# EasyEDA Pro project ProProject_2024电赛校赛_2024-05-27.epro

# Schematic Schematic2
Create Date: 2024-05-11; Page Name: P1; Project Name: 2024电赛校赛; Schematic Name: Schematic2; Update Date: 2024-05-11; Company: 嘉立创EDA; Page Size: A4; Version: V1.0
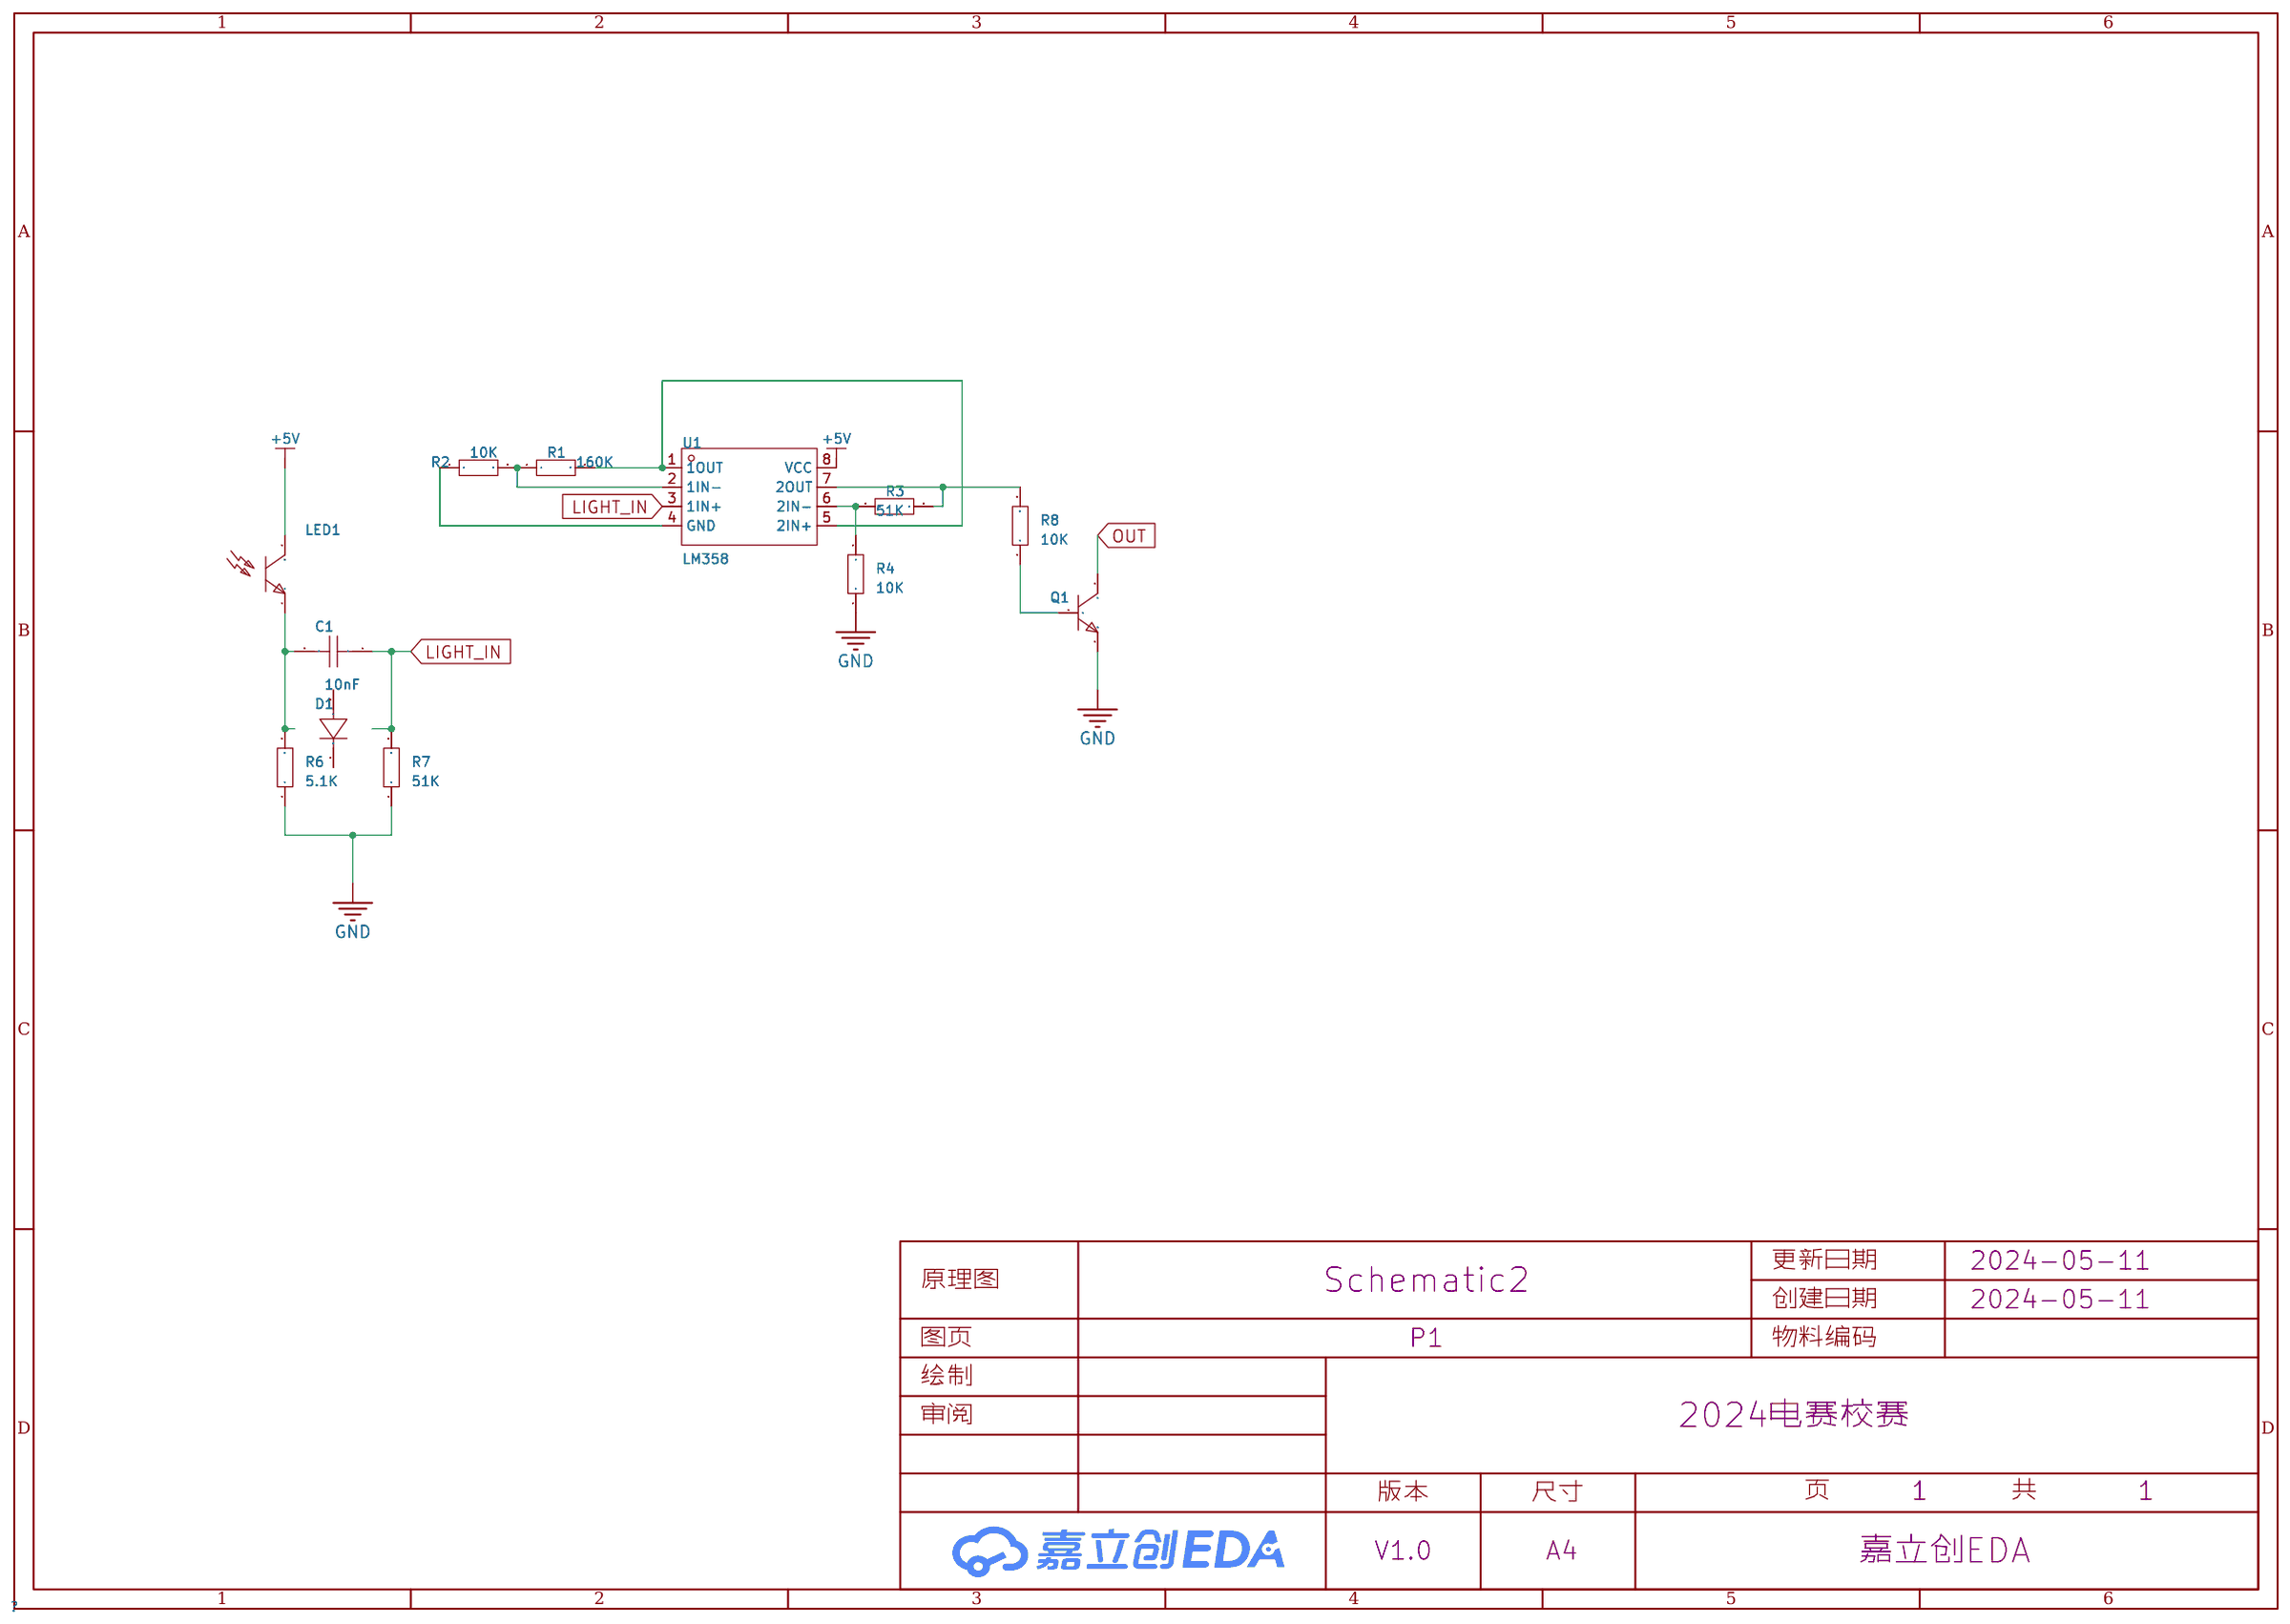
[diagram p0: schematic sheet]

## Parts
C1  10nF  [C0603]
D1  -  [DO_1N4007]
LED1  MHL524PT03BRT  [LED-TH_BD5.8-P2.54-RD]
Q1  -  [S8050_SOT-23]
R1  160K  [R0603]
R2  10K  [R0603]
R3  51K  [R0603]
R4  10K  [R0603]
R6  5.1K  [R0603]
R7  51K  [R0603]
R8  10K  [R0603]
U1  LM358  [SOP-8_L5.0-W4.0-P1.27-LS6.0-BL]

## Library data of the parts
C1 = CAP_0603: Supplier Footprint: 0603
D1 = D_1N4007A: Supplier Footprint: DO-41
LED1 = MHL524PT03BRT: 晶体管类型:NPN;集电极-发射极电压(Vceo):30V;集电极电流-Ic:1.2mA;最大功耗:10mW;集电极暗电流:100nA;峰值波长:940nm;; LCSC Part Name: 940nm的NPN光电三极管; Supplier Part: C405261; Manufacturer: MEIHUA(美华); Supplier Footprint: 插件,D=5mm; Datasheet: https://atta.szlcsc.com/upload/public/pdf/source/20190731/C405261_B286ACA8E3E1B3273BC9C132C68D299C.pdf; Supplier: LCSC; Transistor Type: NPN; Collector Emitter Voltage: 30V; Collector Current (Ic): 1.2mA; Dissipation Power(Max): 10mW; Collector Dark Current: 100nA; Peak Wavelength: 940nm; Operating Temperature: -35℃~+85℃
Q1 = S8050_SOT_NPN: Supplier Footprint: SOT-23
R1-R4 R6-R8 = Res_0603: Supplier Footprint: 0603
U1 = LM358: 放大器数:-;输入失调电压(Vos):9V;带宽(-3db):1MHz;; LCSC Part Name: 停产; Supplier Part: C329455; Manufacturer: IDCHIP(英锐芯); Supplier Footprint: SOP-8; JLCPCB Part Class: 扩展库; Datasheet: https://atta.szlcsc.com/upload/public/pdf/source/20190220/C329455_57B3E72C7E5AADCB3F5B4A8F23CFDE4F.pdf; Supplier: LCSC; Voltage - Input Offset(Vos): 9V; Common Mode Rejection Ratio (CMRR): 65dB; Supply Voltage: 3V~30V; -3db Bandwidth: 1MHz

## Nets
+5V: LED1.2(C) U1.8(VCC)
GND: Q1.2 R4.1 R6.1 R7.1
LIGHT_IN: C1.1 D1.2(A) R7.2 U1.3(1IN+)
OUT: Q1.3
Net-(C1-2): C1.2 D1.1(K) LED1.1(E) R6.2
Net-(Q1-1): Q1.1 R8.1
Net-(R1-1): R1.1 R2.2 U1.2(1IN-)
Net-(R1-2): R1.2 U1.1(1OUT) U1.5(2IN+)
Net-(R2-1): R2.1 U1.4(GND)
Net-(R3-1): R3.1 R4.2 U1.6(2IN-)
Net-(R3-2): R3.2 R8.2 U1.7(2OUT)

# Schematic Schematic1

## Sheets
1 主控: Create Date: 2024-05-06; Page Name: 主控; Project Name: 2024电赛校赛; Schematic Name: Schematic1; Update Date: 2024-05-06; Company: 嘉立创EDA; Page Size: A4; Version: V1.0
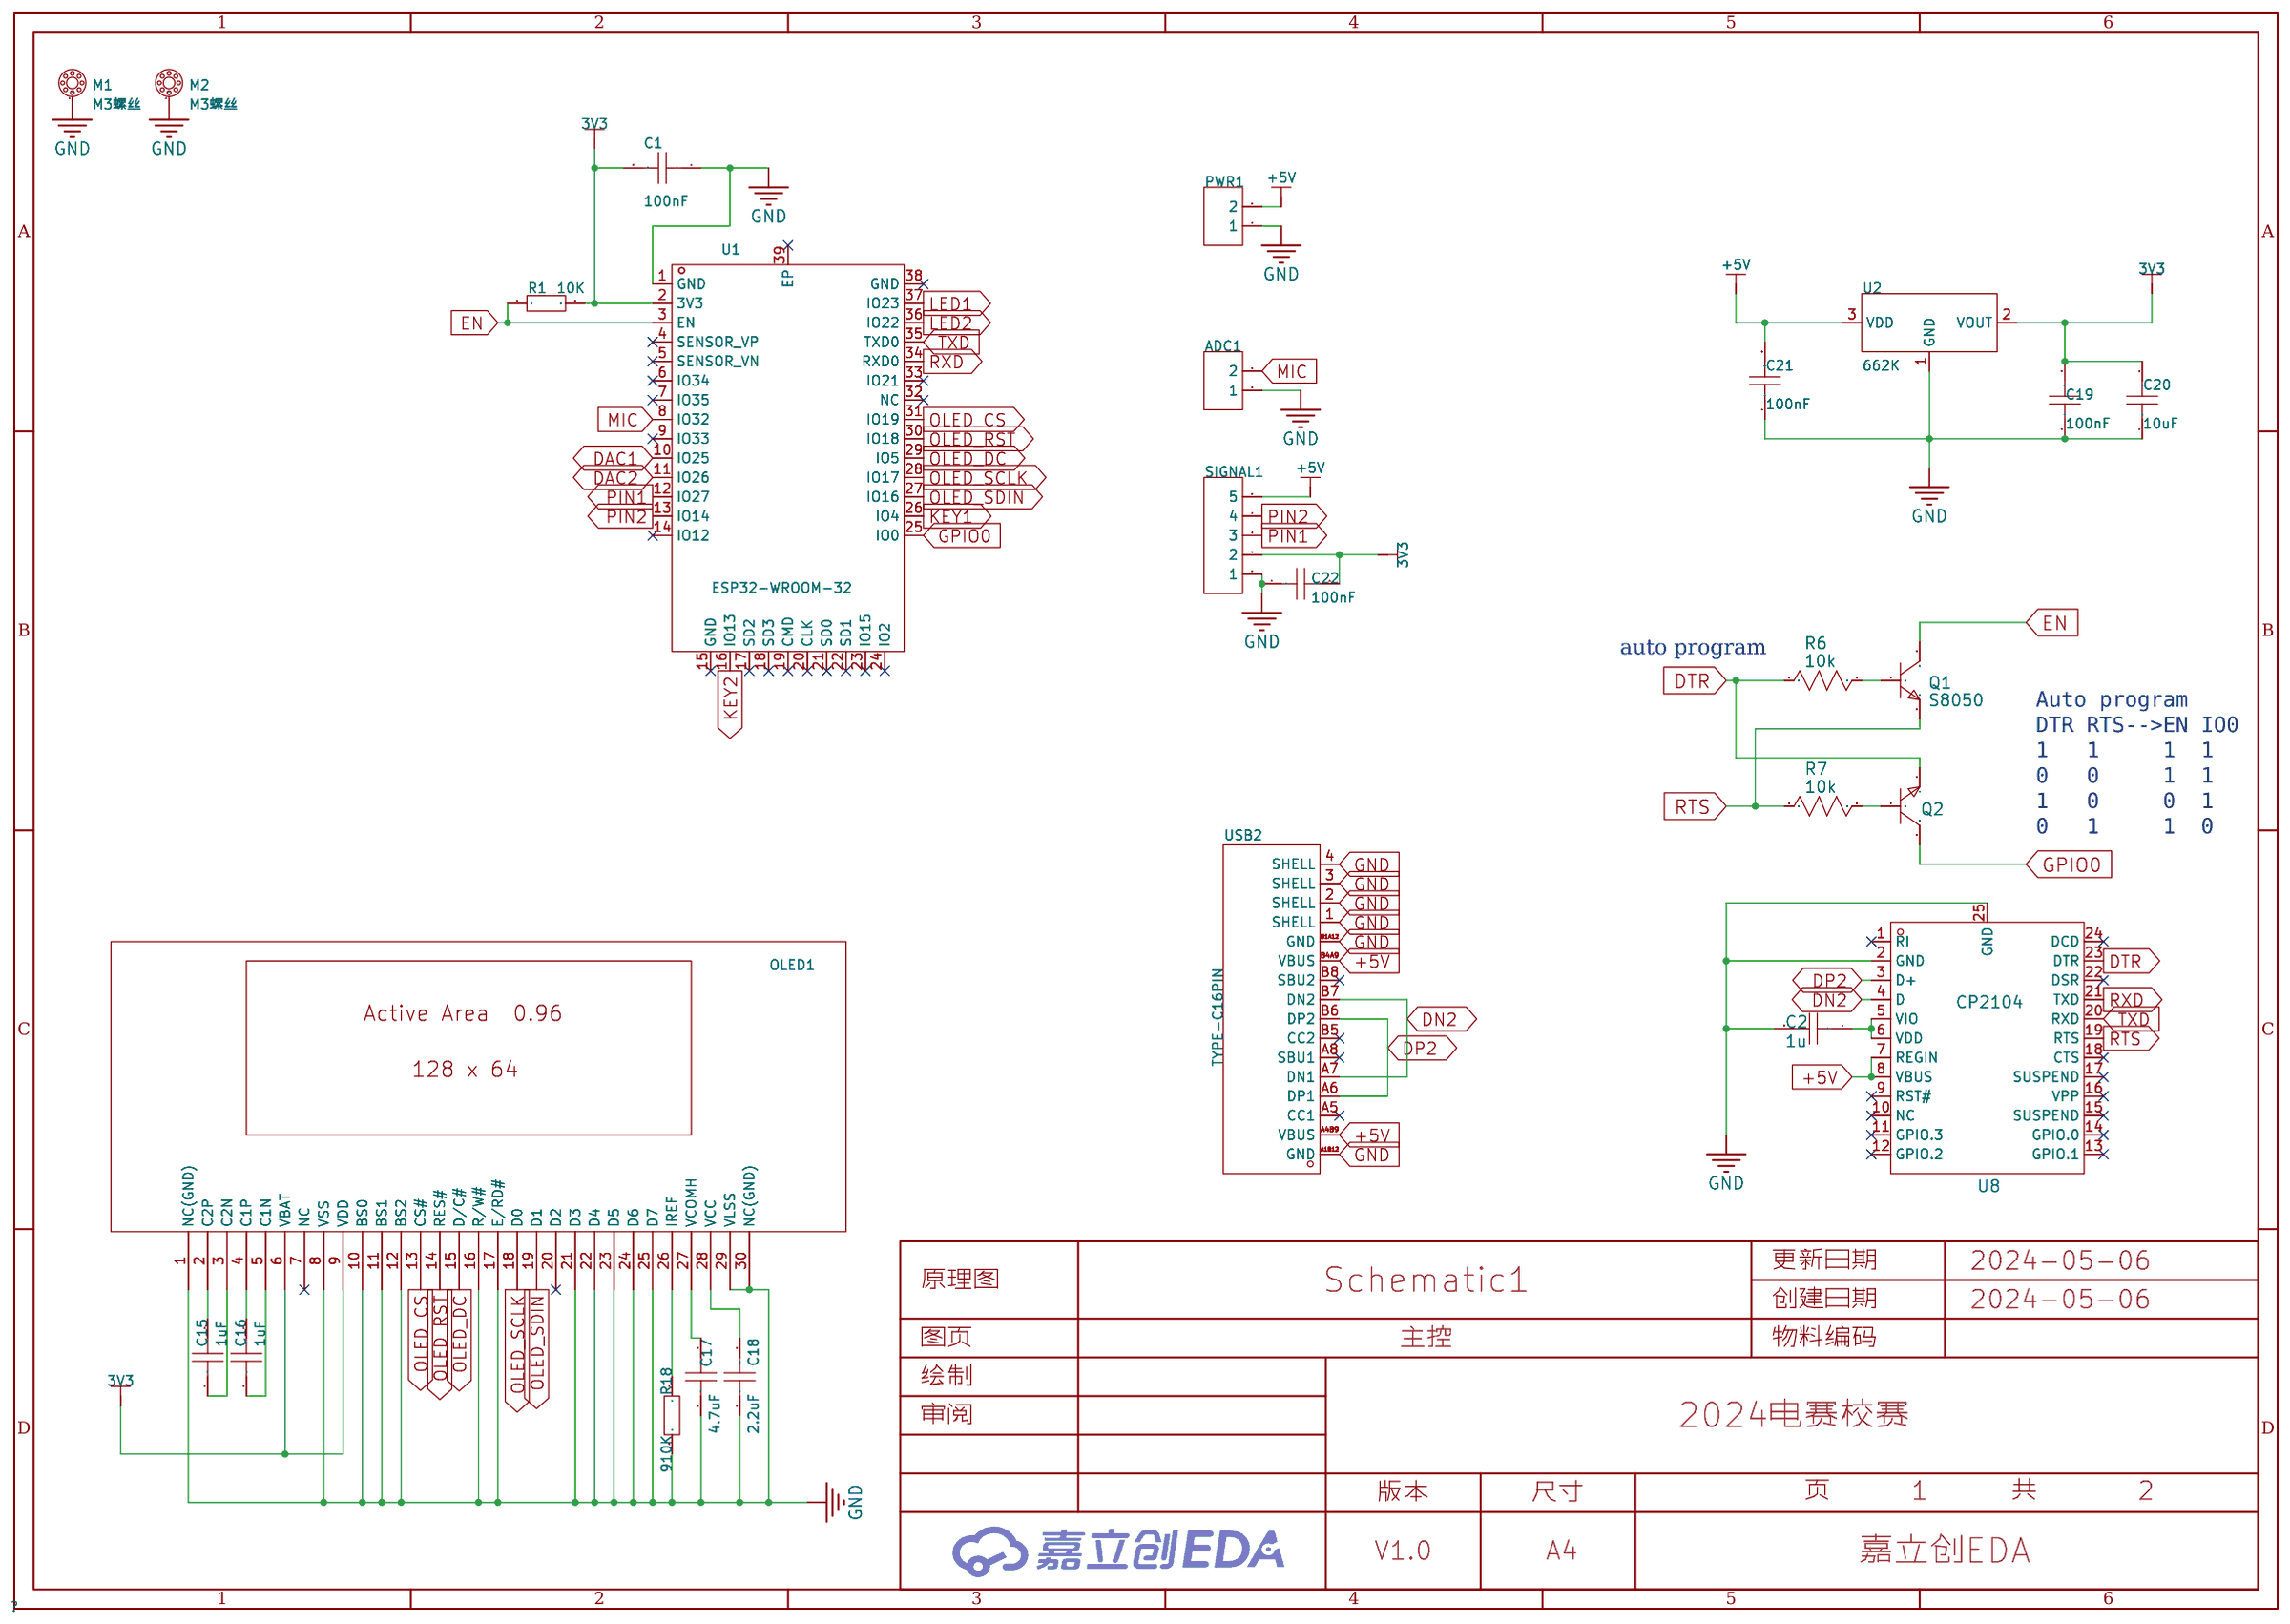
[diagram p1: 主控]
2 外设: Page Name: 外设
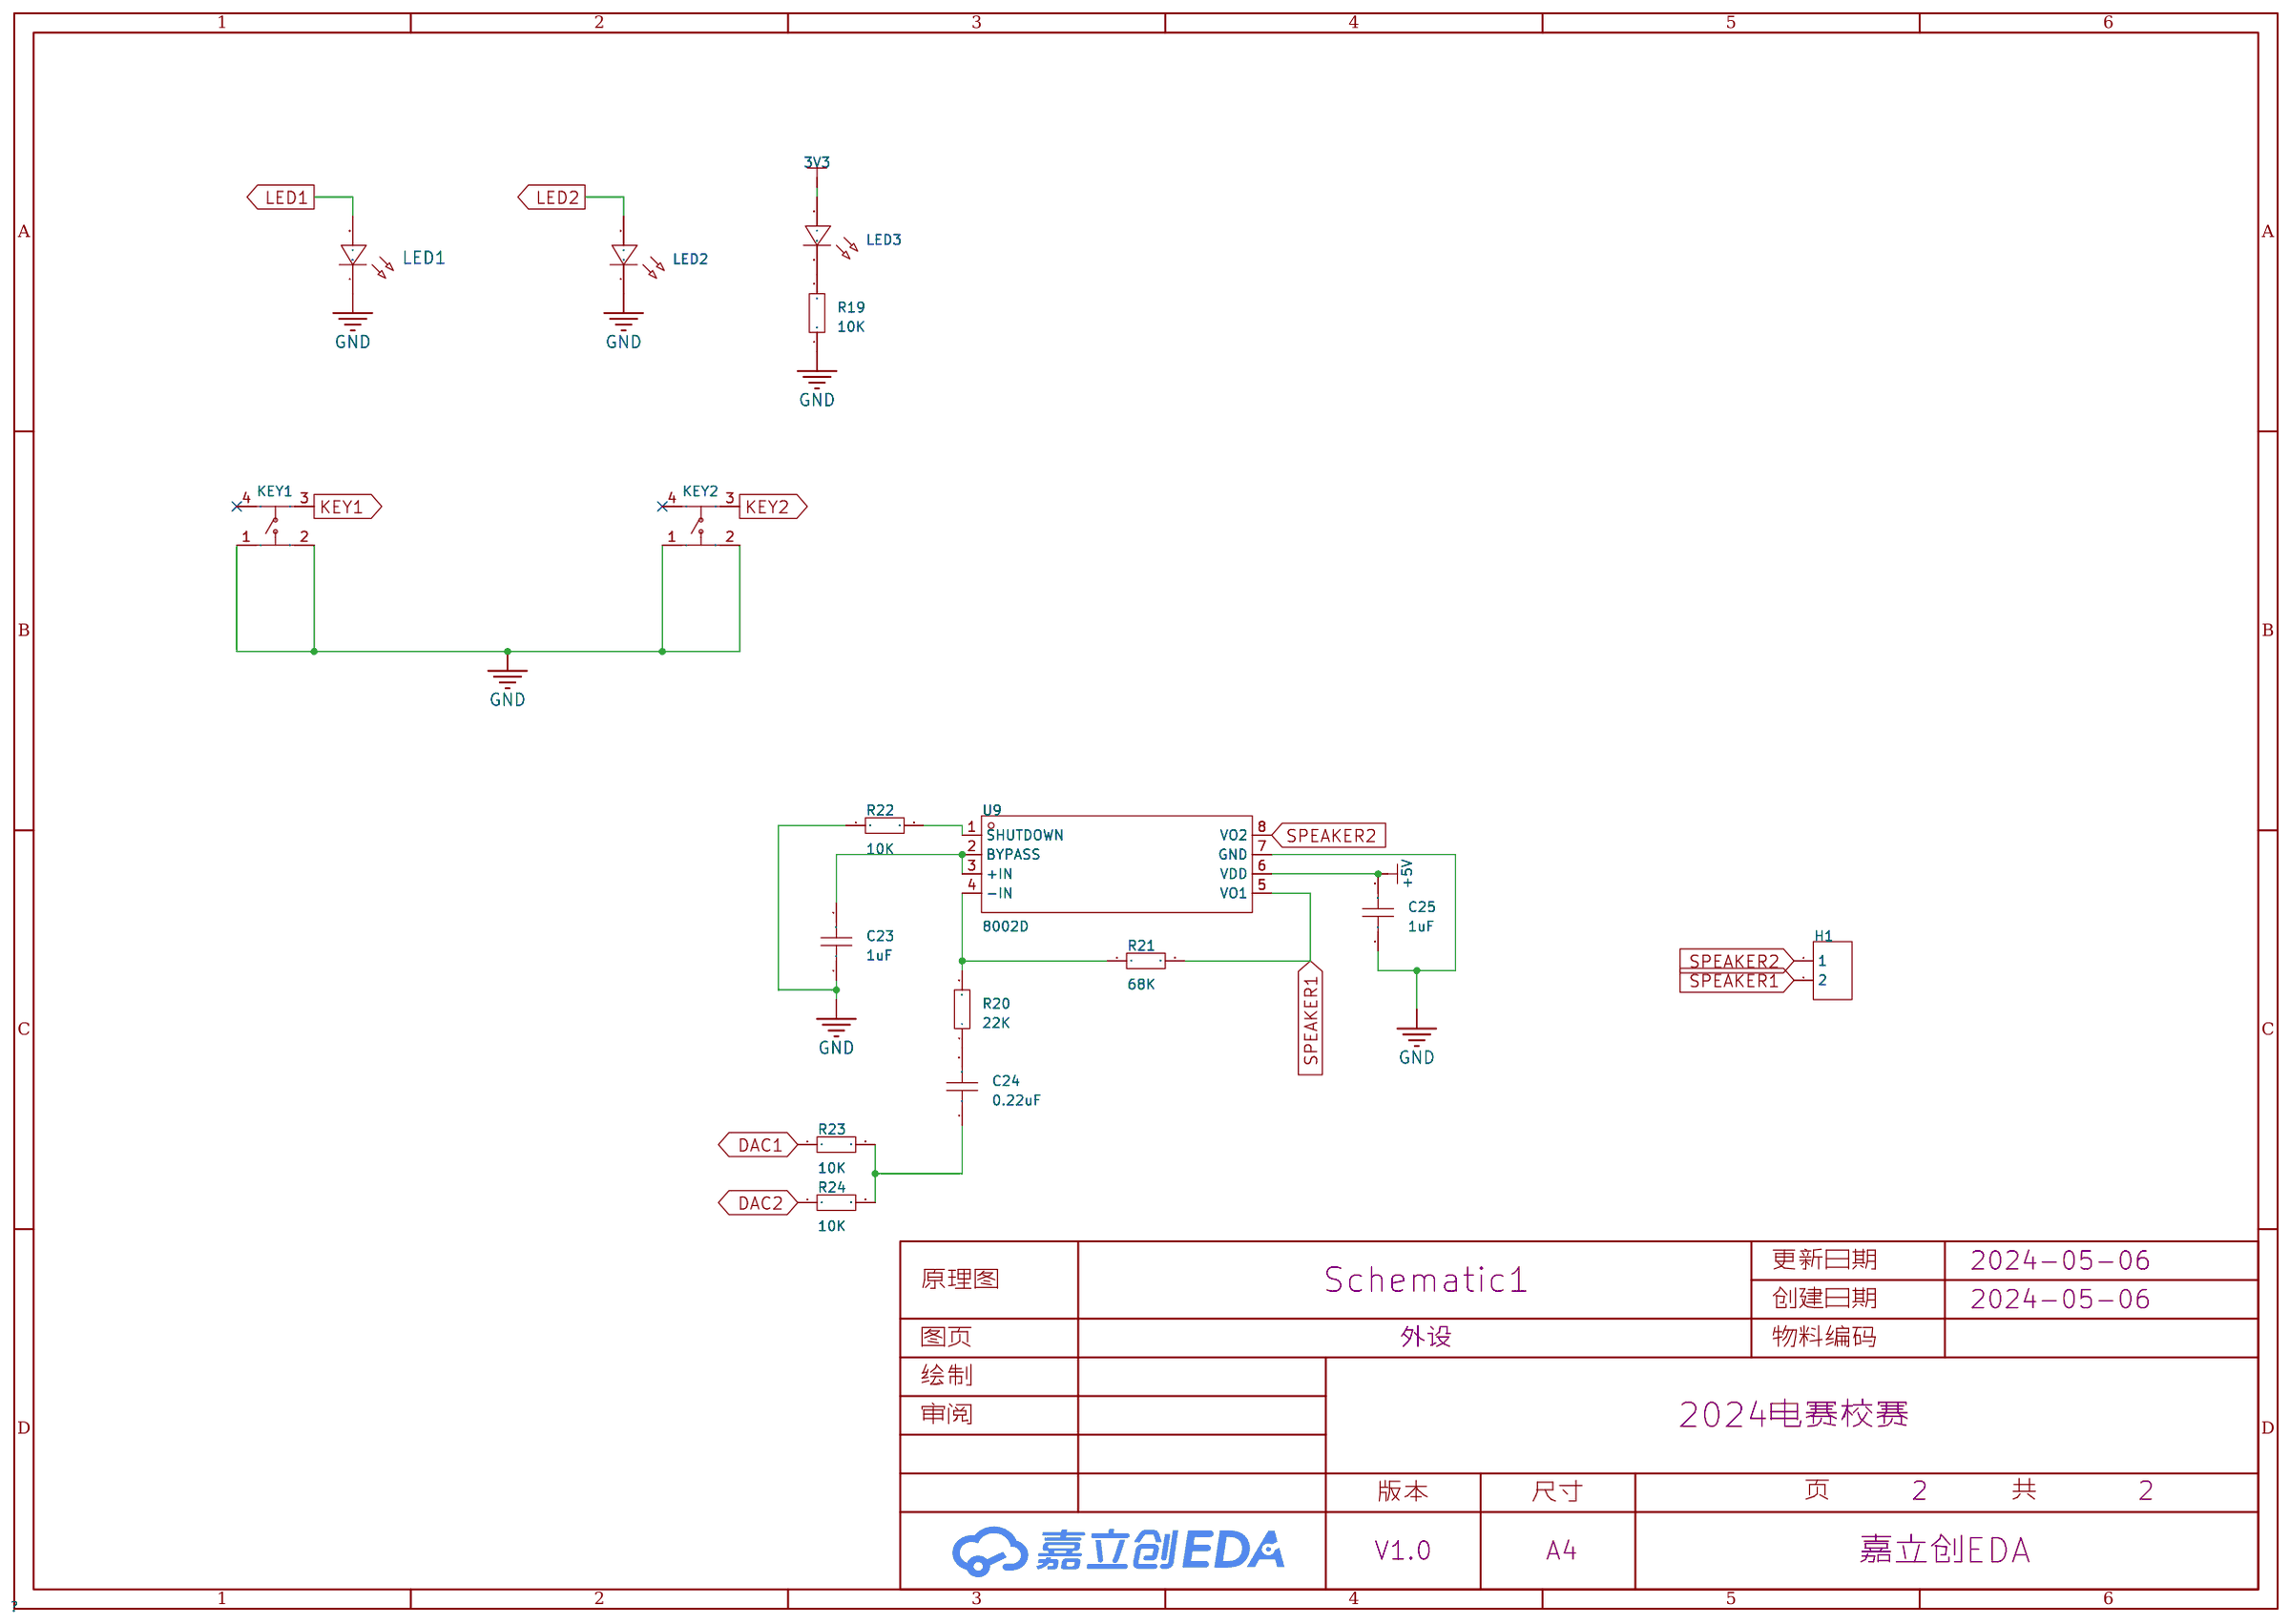
[diagram p2: 外设]

## Parts
sheet 主控
ADC1  -  [HDR-TH_2P-P2.54-V-F]
C1  100nF  [C0603]
C2  1u  [C0603]
C15  1uF  [C0603]
C16  1uF  [C0603]
C17  4.7uF  [C0603]
C18  2.2uF  [C0603]
C19  100nF  [C0603]
C20  10uF  [C0603]
C21  100nF  [C0603]
C22  100nF  [C0603]
M1  M3螺丝  [螺钉孔]
M2  M3螺丝  [螺钉孔]
OLED1  -  [OLED-SMD_QG-2864KSWEG01]
PWR1  -  [HDR-TH_2P-P2.54-V-F]
Q1  S8050  [SOT-23(SOT-23-3)]
Q2  S8050  [SOT-23(SOT-23-3)]
R1  10K  [R0603]
R6  10k  [R0603]
R7  10k  [R0603]
R18  910K  [R0603]
SIGNAL1  -  [HDR-TH_5P-P2.54-V-F]
U1  ESP32-WROOM-32  [WIFIM-SMD_ESP-WROOM-32]
U2  662K  [SOT-23-3_L2.9-W1.3-P1.90-LS2.4-BR]
U8  CP2104  [QFN-24_L4.0-W4.0-P0.50-BL-EP2.7]
USB2  TYPE-C16PIN  [USB-C-SMD_TYPE-C16PIN]
sheet 外设
C23  1uF  [C0603]
C24  0.22uF  [C0603]
C25  1uF  [C0603]
H1  -  [HDR-TH_2P-P2.54-V-F]
KEY1  轻触开关,6*6*6.5塑头,260G,行程0.25mm,直插  [KEY-TH_4P-L6.0-W6.0-P4.50-LS7.5]
KEY2  轻触开关,6*6*6.5塑头,260G,行程0.25mm,直插  [KEY-TH_4P-L6.0-W6.0-P4.50-LS7.5]
LED1  -  [LED_0603]
LED2  -  [LED_0603]
LED3  -  [LED_0603]
R19  10K  [R0603]
R20  22K  [R0603]
R21  68K  [R0603]
R22  10K  [R0603]
R23  10K  [R0603]
R24  10K  [R0603]
U9  8002D  [SOP-8_L4.9-W3.9-P1.27-LS6.0-BL-1]

## Library data of the parts
ADC1 H1 PWR1 = HDR-F_2.54_1x2P: Supplier Part: C49661; Supplier Footprint: 插件
C1 C15-C25 = CAP_0603: Supplier Footprint: 0603
C2 = 1u
M1 M2 = M3螺丝: Pin Type: IN
OLED1 = QG-2864KSWEG01: OLED屏幕 黑底白字; LCSC Part Name: 0.96”128x64 单色白色30pin 150cd/m2 (Typ) @ 9V; Supplier Part: C85007; Manufacturer: 全智景Allvision; Supplier Footprint: 0.96&quot;; Datasheet: https://atta.szlcsc.com/upload/public/pdf/source/20161119/1479540182429.pdf; Supplier: LCSC
Q1 Q2 = SS8050: Supplier: LCSC; Manufacturer: CJ; image: //image.lceda.cn/szlcsc/C2150.jpg; Supplier Part: C2150
R1 R18-R24 = Res_0603: Supplier Footprint: 0603
R6 R7 = 0402WGF1002TCE: Supplier: LCSC; Manufacturer: UniOhm; Supplier Part: C25744
SIGNAL1 = HDR-F_2.54_1x5P: Supplier Part: C50950; Supplier Footprint: 插件
U1 = ESP32-WROOM-32: WiFi+双模蓝牙 双核CPU 网口 顶配MCU 低功耗蓝牙 ESP32系列ESP-WROOM-32模组/ESP-32S 4MB; Supplier Part: C95209; Manufacturer: ESPRESSIF(乐鑫); JLCPCB Part Class: 扩展库; Datasheet: https://atta.szlcsc.com/upload/public/pdf/source/20170925/C95209_1506321763821990573.pdf; Supplier: LCSC
U2 = 662K: 输出类型:固定;最大输入电压:8V;输出电压:3.3V;最大输出电流:300mA;输出极性:正极;; LCSC Part Name: 662K. 输入8V 300mA; Supplier Part: C7470756; Manufacturer: HXY MOSFET(华轩阳电子); Supplier Footprint: SOT-23; JLCPCB Part Class: 扩展库; Datasheet: https://atta.szlcsc.com/upload/public/pdf/source/20230915/BA72989D17401E2852D389BF12EDF43F.pdf; Supplier: LCSC; Output Type: 固定; Maximum Input Voltage: 8V; Output Voltage: 3.3V; MAX Output Current: 300mA; Output Polarity: 正极; Number of Outputs: 1
U8 = CP2104: Supplier: LCSC; Supplier Part: C9900015322; Manufacturer: null; JLCPCB Part Class: Extended Part
USB2 = TYPE-C16PIN: 连接器类型:Type-C;标准:-;公母:母座;触点数量:16;端口数量:1;安装方式:卧贴;额定电流 - 电源:3A;工作温度范围:-40~+85;; LCSC Part Name: Type-C 母座 卧贴 停产 快充闪充 停产; Supplier Part: C393939; Manufacturer: SHOU HAN(首韩); Supplier Footprint: SMD; JLCPCB Part Class: 扩展库; Datasheet: https://atta.szlcsc.com/upload/public/pdf/source/20190521/C393939_7B9043D4CF1026AF443AB60D91FBCD5C.pdf; Supplier: LCSC; Connector Type: Type-C; Gender: 母座; Number of Contacts: 16; Number of Ports: 1; Mounting Style: 卧贴; Current Rating - Power (Max): 3A; Operating Temperature Range: -40~+85
KEY1 KEY2 = 轻触开关,6*6*6.5塑头,260G,行程0.25mm,直插: Supplier Part: C71841; Supplier Footprint: 插件; JLCPCB Part Class: 扩展库; Supplier: LCSC
LED1 = LED_0603-R: Supplier Footprint: 0603
LED2 LED3 = LED_0603-G: Supplier Footprint: 0603
U9 = 8002D_C329450: 功放类型:-;扬声器通道数:单声道;输出功率:-;静态电流(Iq):-;; Supplier Part: C329450; Manufacturer: IDCHIP(英锐芯); Supplier Footprint: SOP-8; JLCPCB Part Class: 扩展库; Datasheet: https://atta.szlcsc.com/upload/public/pdf/source/20181204/C329450_6E9EAEE0A0B0DD26C675056EEE13A9C9.pdf; Supplier: LCSC; Speaker Channels: 单声道; Supply Voltage: 2.2V~6.5V

## Nets
3V3: C1.2 C19.2 C20.2 C22.2 LED3.2(A) OLED1.6(VBAT) OLED1.9(VDD) R1.2 SIGNAL1.2 U1.2(3V3) U2.2(VOUT)
+5V: C21.2 C25.2 PWR1.2 SIGNAL1.5 U2.3(VDD) U8.7(REGIN) U8.8(VBUS) U9.6(VDD) USB2.A4B9(VBUS) USB2.B4A9(VBUS)
GND: ADC1.1 C1.1 C2.2 C17.1 C18.1 C19.1 C20.1 C21.1 C22.1 C23.1 C25.1 KEY1.1 KEY1.2 KEY2.1 KEY2.2 LED1.1(C) LED2.1(C) M1.1 M2.1 OLED1.1(NC(GND)) OLED1.8(VSS) OLED1.10(BS0) OLED1.11(BS1) OLED1.12(BS2) OLED1.16(R/W#) OLED1.17(E/RD#) OLED1.21(D3) OLED1.22(D4) OLED1.23(D5) OLED1.24(D6) OLED1.25(D7) OLED1.29(VLSS) OLED1.30(NC(GND)) PWR1.1 R18.2 R19.1 R22.1 SIGNAL1.1 U1.1(GND) U2.1(GND) U8.2(GND) U8.25(GND) U9.7(GND) USB2.1(SHELL) USB2.2(SHELL) USB2.3(SHELL) USB2.4(SHELL) USB2.A1B12(GND) USB2.B1A12(GND)
DAC1: R23.1 U1.10(IO25)
DAC2: R24.1 U1.11(IO26)
DN2: U8.4(D) USB2.A7(DN1) USB2.B7(DN2)
DP2: U8.3(D+) USB2.A6(DP1) USB2.B6(DP2)
DTR: Q2.2(E) R6.1 U8.23(DTR)
EN: Q1.3(C) R1.1 U1.3(EN)
GPIO0: Q2.3(C) U1.25(IO0)
KEY1: KEY1.3 U1.26(IO4)
KEY2: KEY2.3 U1.16(IO13)
LED1: LED1.2(A) U1.37(IO23)
LED2: LED2.2(A) U1.36(IO22)
MIC: ADC1.2 U1.8(IO32)
OLED_CS: OLED1.13(CS#) U1.31(IO19)
OLED_DC: OLED1.15(D/C#) U1.29(IO5)
OLED_RST: OLED1.14(RES#) U1.30(IO18)
OLED_SCLK: OLED1.18(D0) U1.28(IO17)
OLED_SDIN: OLED1.19(D1) U1.27(IO16)
PIN1: SIGNAL1.3 U1.12(IO27)
PIN2: SIGNAL1.4 U1.13(IO14)
RTS: Q1.2(E) R7.1 U8.19(RTS)
RXD: U1.34(RXD0) U8.21(TXD)
SPEAKER1: H1.2 R21.2 U9.5(VO1)
SPEAKER2: H1.1 U9.8(VO2)
TXD: U1.35(TXD0) U8.20(RXD)
$1N817: C16.2 OLED1.4(C1P)
$1N818: C16.1 OLED1.5(C1N)
$1N820: OLED1.26(IREF) R18.1
$1N821: C17.2 OLED1.27(VCOMH)
$1N822: C18.2 OLED1.28(VCC)
$1N828: C15.1 OLED1.3(C2N)
$1N829: C15.2 OLED1.2(C2P)
$1N1195: C2.1 U8.5(VIO) U8.6(VDD)
$1N1621: Q1.1(B) R6.2
$1N1627: Q2.1(B) R7.2
$2N655: LED3.1(C) R19.2
$2N970: C23.2 U9.2(BYPASS) U9.3(+IN)
$2N1135: R20.2 R21.1 U9.4(-IN)
$2N1191: C24.2 R20.1
$2N1359: R22.2 U9.1(SHUTDOWN)
$2N1492: C24.1 R23.2 R24.2

Not connected (* = marked no-connect by the designer): KEY1 4*; KEY2 4*; OLED1 7(NC)* 20(D2)*; U1 4(SENSOR_VP)* 5(SENSOR_VN)* 6(IO34)* 7(IO35)* 9(IO33)* 14(IO12)* 15(GND)* 17(SD2)* 18(SD3)* 19(CMD)* 20(CLK)* 21(SD0)* 22(SD1)* 23(IO15)* 24(IO2)* 32(NC)* 33(IO21)* 38(GND)* 39(EP)*; U8 1(RI)* 9(RST#)* 10(NC)* 11(GPIO.3)* 12(GPIO.2)* 13(GPIO.1)* 14(GPIO.0)* 15(SUSPEND)* 16(VPP)* 17(SUSPEND)* 18(CTS)* 22(DSR)* 24(DCD)*; USB2 A5(CC1)* A8(SBU1)* B5(CC2)* B8(SBU2)*

## Notes on the sheets
sheet 1
- auto program
- Auto program
  DTR RTS-->EN IO0
  1   1     1  1
  0   0     1  1
  1   0     0  1
  0   1     1  0

# Board PCB1
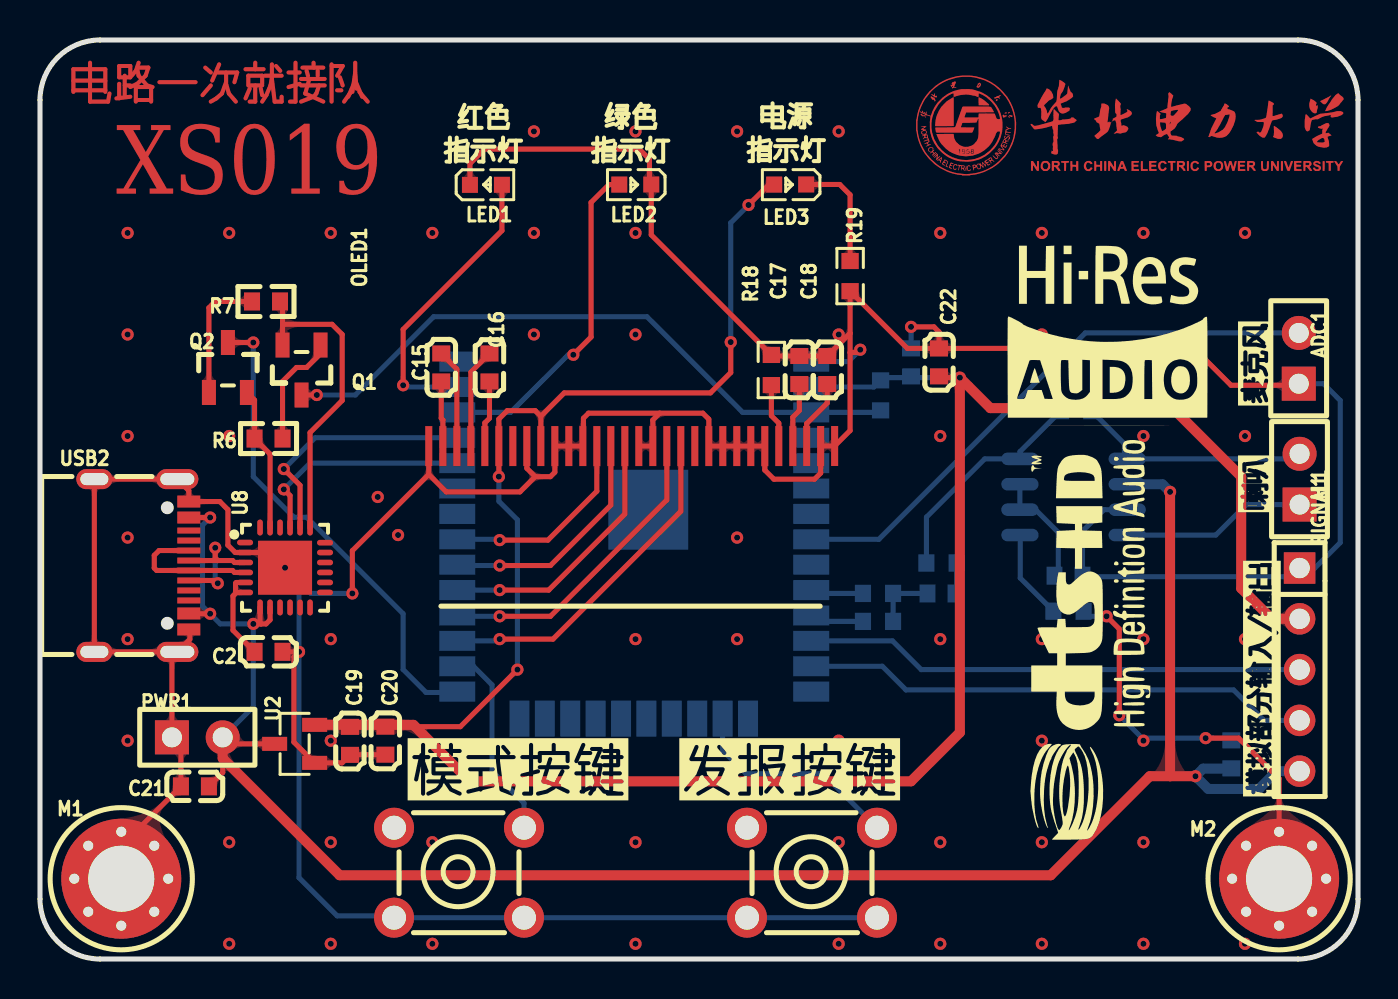
[diagram p3: board, top side]
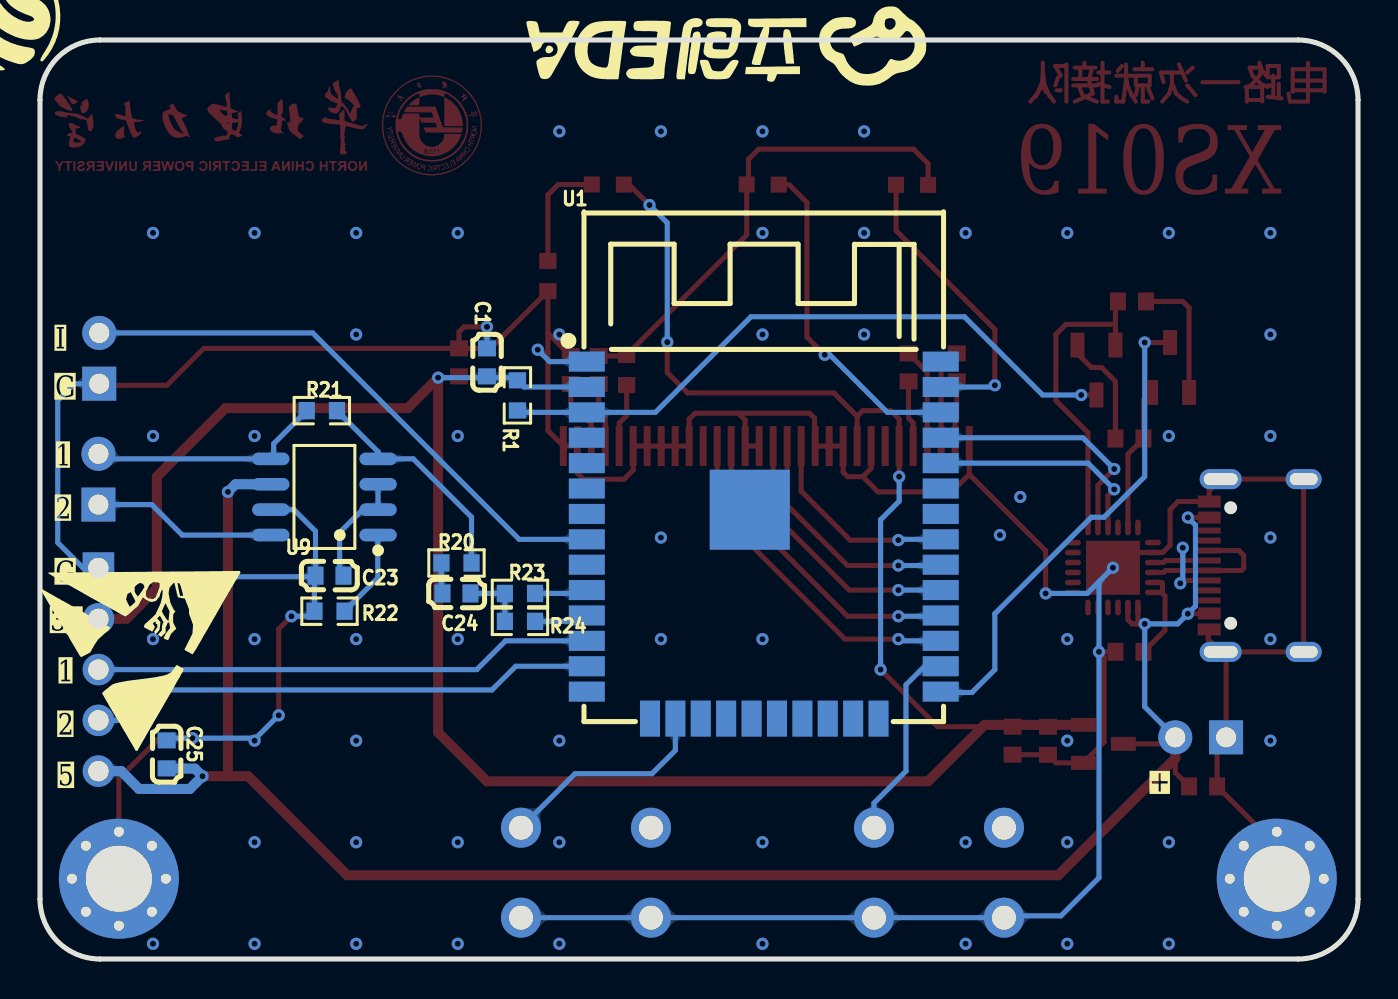
[diagram p4: board, bottom side, seen from below]

Outline 65.91 x 45.97 mm; copper layers: Top Layer, Bottom Layer. Coordinates in mm from the lower left corner of the outline.
Outline path: 0,42.97 0,3 arc(0.88,0.88) 3,0 62.91,0 arc(65.03,0.88) 65.91,3 65.91,42.97 arc(65.03,45.1) 62.91,45.97 3,45.97 arc(0.88,45.1) 0,42.97
Stack: Top Layer 0.035mm / Dielectric1 1.51mm FR4 er 4.5 / Bottom Layer 0.035mm

## Design rules (mm)
template: JLCPCB Capability(Two Layers Board)
spacing copperThickness1oz (default): track to track 0.102, other pairs 0.152 to 0.3
spacing copperThickness2oz: track to track 0.203, other pairs 0.152 to 0.3
track width copperThickness1oz (default): min 0.127, default 0.254, max 2.54
track width copperThickness2oz: min 0.203, default 0.254, max 2.54
differential pair differentialPair (default): width min 0.127, default 0.254, max 2.54; gap min 0.152, default 0.152
via viaSize (default): diameter min 0.5, default 0.61, max 10; hole min 0.3, default 0.305, max 6.3

## Placement (name value [footprint] x y rotation side)
ADC1  -  [HDR-TH_2P-P2.54-V-F]  62.95 30.05 90 top
C1  100nF  [C0603]  43.56 29.85 270 bottom
C2  1u  [C0603]  11.43 15.37 0 top
C15  1uF  [C0603]  20.07 29.59 270 top
C16  1uF  [C0603]  22.48 29.59 90 top
C17  4.7uF  [C0603]  37.97 29.46 270 top
C18  2.2uF  [C0603]  39.37 29.46 270 top
C19  100nF  [C0603]  15.5 10.91 90 top
C20  10uF  [C0603]  17.27 10.92 90 top
C21  100nF  [C0603]  7.75 8.64 0 top
C22  100nF  [C0603]  44.96 29.85 270 top
C23  1uF  [C0603]  51.44 19.18 180 bottom
C24  0.22uF  [C0603]  45.08 18.29 0 bottom
C25  1uF  [C0603]  59.58 10.24 270 bottom
H1  -  [HDR-TH_2P-P2.54-V-F]  62.99 24 90 top
KEY1  轻触开关,6*6*6.5塑头,260G,行程0.25mm,直插  [KEY-TH_4P-L6.0-W6.0-P4.50-LS7.5]  20.95 4.32 0 top
KEY2  轻触开关,6*6*6.5塑头,260G,行程0.25mm,直插  [KEY-TH_4P-L6.0-W6.0-P4.50-LS7.5]  38.61 4.32 0 top
LED1  -  [LED_0603]  22.35 38.74 0 top
LED2  -  [LED_0603]  29.72 38.74 180 top
LED3  -  [LED_0603]  37.47 38.74 180 top
M1  M3螺丝  [螺钉孔]  4.06 4.02 0 top
M2  M3螺丝  [螺钉孔]  61.97 4.02 0 top
OLED1  -  [OLED-SMD_QG-2864KSWEG01]  29.59 22.86 0 top
PWR1  -  [HDR-TH_2P-P2.54-V-F]  7.87 11.09 0 top
Q1  S8050  [SOT-23(SOT-23-3)]  13.08 29.46 180 top
Q2  S8050  [SOT-23(SOT-23-3)]  9.4 29.59 0 top
R1  10K  [R0603]  42.04 28.19 90 bottom
R6  10k  [R0603#2]  11.43 26.04 0 top
R7  10k  [R0603#2]  11.3 32.89 180 top
R18  910K  [R0603]  36.58 29.46 90 top
R19  10K  [R0603]  40.51 34.16 90 top
R20  22K  [R0603]  45.08 19.81 180 bottom
R21  68K  [R0603]  51.82 27.43 0 bottom
R22  10K  [R0603]  51.44 17.4 180 bottom
R23  10K  [R0603]  41.91 18.29 0 bottom
R24  10K  [R0603]  41.91 16.89 0 bottom
SIGNAL1  -  [HDR-TH_5P-P2.54-V-F]  62.99 14.48 270 top
U1  ESP32-WROOM-32  [WIFIM-SMD_ESP-WROOM-32]  29.72 20.96 180 bottom
U2  662K  [SOT-23-3_L2.9-W1.3-P1.90-LS2.4-BR]  12.73 10.76 0 top
U8  CP2104  [QFN-24_L4.0-W4.0-P0.50-BL-EP2.7]  12.25 19.59 270 top
U9  8002D  [SOP-8_L4.9-W3.9-P1.27-LS6.0-BL-1]  51.69 23.11 90 bottom
USB2  TYPE-C16PIN  [USB-C-SMD_TYPE-C16PIN]  5.08 19.69 270 top

## Footprints (pads in the part's own frame, mm; a bottom-side part is the same pattern mirrored in y, then rotated)
C0603
  rect 0.8x0.9 smd: 1(-0.7,0) 2(0.7,0)
HDR-TH_2P-P2.54-V-F
  rect 1.7x1.7 hole 1: 1(-1.27,0)
  round 1.7 hole 1: 2(1.27,0)
HDR-TH_5P-P2.54-V-F
  rect 1.575x1.575 hole 1.02: 1(-5.08,0)
  round 1.575 hole 1.02: 2(-2.54,0) 3(0,0) 4(2.54,0) 5(5.08,0)
KEY-TH_4P-L6.0-W6.0-P4.50-LS7.5
  round 2 hole 1.2: 1(-3.25,-2.25) 2(3.25,-2.25) 3(3.25,2.25) 4(-3.25,2.25)
LED_0603
  rect 0.8x0.8 smd: 1(-0.851,-0.01) 2(0.75,-0.005)
OLED-SMD_QG-2864KSWEG01
  rect 0.35x2 smd: 1(-10.149,2.797) 2(-9.444,2.8) 3(-8.744,2.8) 4(-8.044,2.8) 5(-7.344,2.8) 6(-6.644,2.8) 7(-5.944,2.8) 8(-5.244,2.8) 9(-4.544,2.8) 10(-3.844,2.8) 11(-3.144,2.8) 12(-2.444,2.8) 13(-1.744,2.8) 14(-1.044,2.8) 15(-0.344,2.8) 16(0.356,2.8) 17(1.056,2.8) 18(1.756,2.8) 19(2.456,2.8) 20(3.156,2.8) 21(3.856,2.8) 22(4.556,2.8) 23(5.256,2.8) 24(5.956,2.8) 25(6.656,2.8) 26(7.356,2.8) 27(8.056,2.8) 28(8.751,2.801) 29(9.45,2.803) 30(10.149,2.803)
QFN-24_L4.0-W4.0-P0.50-BL-EP2.7
  oval 0.28x0.8 smd: 1(-1.25,-2) 2(-0.75,-2) 3(-0.25,-2) 4(0.25,-2) 5(0.75,-2) 6(1.25,-2) 13(1.25,2) 14(0.75,2) 15(0.25,2) 16(-0.25,2) 17(-0.75,2) 18(-1.242,2)
  oval 0.8x0.28 smd: 7(2,-1.25) 8(2,-0.75) 9(2,-0.25) 10(2,0.25) 11(2,0.75) 12(2,1.25) 19(-2,1.25) 20(-2,0.75) 21(-2,0.25) 22(-2,-0.25) 23(-2,-0.75) 24(-2,-1.25)
  rect 2.7x2.7 smd: 25(0.013,0)
R0603
  rect 0.806x0.864 smd: 1(-0.753,0) 2(0.753,0)
R0603#2
  rect 0.8x0.9 smd: 1(-0.7,0) 2(0.7,0)
SOP-8_L4.9-W3.9-P1.27-LS6.0-BL-1
  oval 0.63x1.865 smd: 1(-1.905,-2.683) 2(-0.635,-2.683) 3(0.635,-2.683) 4(1.905,-2.683) 5(1.905,2.683) 6(0.635,2.683) 7(-0.635,2.683) 8(-1.905,2.683)
SOT-23(SOT-23-3)
  rect 0.7x1.25 smd: 1(-0.95,-1.25) 2(0.95,-1.25) 3(0,1.25)
SOT-23-3_L2.9-W1.3-P1.90-LS2.4-BR
  rect 1.25x0.7 smd: 1(1,-0.95) 2(1,0.95) 3(-1,0)
USB-C-SMD_TYPE-C16PIN
  oval 1.001x2.1 hole 0.6x1.7: 1(-4.321,1.788) 2(4.321,1.788)
  oval 1.001x1.801 hole 0.6x1.399: 3(-4.321,-2.362) 4(4.321,-2.362)
  rect 0.6x1.151 smd: A1B12(-3.2,2.362) A4B9(-2.401,2.362) B1A12(3.2,2.362) B4A9(2.401,2.362)
  rect 0.299x1.151 smd: A5(-1.25,2.362) A6(-0.249,2.362) A7(0.249,2.362) A8(-1.75,2.362) B5(1.75,2.362) B6(0.75,2.362) B7(-0.75,2.362) B8(1.25,2.362)
WIFIM-SMD_ESP-WROOM-32
  rect 1.8x1.001 smd: 1(-8.851,8.931) 2(-8.851,7.66) 3(-8.851,6.391) 4(-8.851,5.12) 5(-8.851,3.85) 6(-8.851,2.58) 7(-8.851,1.31) 8(-8.851,0.041) 9(-8.851,-1.23) 10(-8.851,-2.499) 11(-8.851,-3.769) 12(-8.851,-5.04) 13(-8.851,-6.309) 14(-8.851,-7.58) 25(8.851,-7.58) 26(8.851,-6.309) 27(8.851,-5.04) 28(8.851,-3.769) 29(8.851,-2.499) 30(8.851,-1.23) 31(8.851,0.041) 32(8.851,1.31) 33(8.851,2.58) 34(8.851,3.85) 35(8.851,5.12) 36(8.851,6.391) 37(8.851,7.66) 38(8.851,8.931)
  rect 1.001x1.8 smd: 15(-5.689,-8.931) 16(-4.42,-8.931) 17(-3.15,-8.931) 18(-1.879,-8.931) 19(-0.61,-8.931) 20(0.66,-8.931) 21(1.931,-8.931) 22(3.2,-8.931) 23(4.471,-8.931) 24(5.74,-8.931)
  rect 4x4 smd: 39(-0.7,1.52)
螺钉孔
  round 1 hole 0.5: 1(-2.349,0) 1(-1.651,1.651) 1(-1.651,-1.651) 1(0,2.349) 1(0,-2.349) 1(1.651,1.651) 1(1.651,-1.651) 1(2.349,0)
  round 6 hole 3.302: 1(0,0)

## Nets
As in the schematic.

Pads without a net: KEY1 4; KEY2 4; OLED1 7 20; U1 4 5 6 7 9 14 15 17 18 19 20 21 22 23 24 32 33 38 39; U8 1 9 10 11 12 13 14 15 16 17 18 22 24; USB2 A5 A8 B5 B8

## Via types
v1: diameter 0.61, hole 0.305, Top Layer to Bottom Layer, 33 vias
v2: diameter 0.61, hole 0.304, Top Layer to Bottom Layer, 56 vias

## Routing (per net, layer and track width the routed paths; a pad name or vN(x,y) marks a point on that pad's centre or on a via; arc(x,y) is an arc through that point)
3V3: length 133.6
  Top Layer w0.254: C22.2 45.02,29.08 v1(46,29.08) ; OLED1.9 25.05,27.15 ; 25.05,27.15 26.22,28.32 33.53,28.32 34.54,29.34 v1(34.54,30.86) ; 25.05,27.15 24.76,27.43 23.37,27.43 22.95,27.01 OLED1.6 v1(22.95,24.13) ; v1(35.43,37.72) 36.45,38.74 LED3.2 ; v1(23.88,14.48) 21.02,11.62 C20.2 17.26,11.61 C19.2 15.4,11.71
  Top Layer w0.5: SIGNAL1.2 61.59,17.02 60.07,18.54 60.07,24.13 56.64,27.56 47.53,27.56 v1(46,29.08) 46,11.33 43.56,8.89 21.5,8.89 18.67,11.71 U2.2
  Bottom Layer w0.254: 43.62,29.08 C1.2 ; 43.62,29.08 v1(46,29.08) ; 43.62,29.08 42.17,29.08 R1.2 41.7,28.62 U1.2 ; v1(35.43,37.72) 34.54,36.83 v1(34.54,30.86) ; v1(22.95,24.13) 22.95,22.9 23.88,21.97 v1(23.88,14.48)
+5V: length 101.2
  Top Layer w0.254: PWR1.2 9.46,10.76 U2.3 ; C21.2 9.14,9.33 9.14,10.04 ; 11,17.59 11,16.81 11.05,16.76 ; 11.05,16.76 11.3,16.76 11.5,16.97 11.5,17.59 ; 11.05,16.76 v1(10.67,16.76) ; USB2.A4B9 v1(8.51,22.09) ; v1(8.51,17.27) 7.45,17.27 USB2.B4A9
  Top Layer w0.5: v1(57.78,9.14) 56.51,9.14 ; 56.51,9.14 55.5,9.14 50.55,4.19 14.99,4.19 9.14,10.04 PWR1.2 ; 56.51,9.14 v1(56.51,23.37)
  Bottom Layer w0.254: v1(8.51,22.09) 8.13,21.7 8.13,17.65 v1(8.51,17.27) 9.02,16.76 v1(10.67,16.76) 10.67,12.62 PWR1.2
  Bottom Layer w0.5: SIGNAL1.5 61.85,9.4 60.96,8.51 58.42,8.51 v1(57.78,9.14) 58.17,9.53 59.57,9.53 C25.2 ; v1(56.51,23.37) 56.13,23.75 U9.6
GND: length 258.6
  Top Layer w0.254: M1.1 4.06,5.65 C21.1 7.05,10.64 PWR1.1 6.6,15.09 USB2.2 ; ADC1.1 62.87,28.7 59.56,28.7 57.72,30.55 C22.1 ; OLED1.8 24.35,24.55 24.76,24.13 ; 40.51,31.31 R19.1 43.38,30.55 C22.1 ; 40.51,31.31 C18.1 C17.1 36.63,30.16 R18.2 30.57,36.22 LED2.1 30.48,38.83 30.48,40.01 29.97,40.51 22.22,40.51 21.5,39.79 LED1.1 ; 40.51,31.31 40.51,30.34 ; 19.44,24.25 15.62,20.43 v1(15.62,18.29) ; 19.44,24.25 20.32,23.37 24,23.37 24.76,24.13 ; 19.44,24.25 OLED1.1 ; v1(58.29,11.05) 59.94,11.05 61.97,9.03 M2.1 M2.1 ; C20.1 15.51,10.22 C19.1 15.1,9.81 U2.1 12.7,10.85 12.7,15.11 v1(12.95,15.37) C2.2 ; OLED1.16 OLED1.17 30.65,26.96 30.99,27.31 ; 30.99,27.31 33.15,27.31 33.45,27.01 OLED1.21 OLED1.22 OLED1.23 OLED1.24 OLED1.25 36.25,24.46 36.7,24 38.73,24 39.04,24.31 OLED1.29 OLED1.30 40.51,26.44 40.51,30.34 ; 30.99,27.31 27.43,27.31 27.18,27.05 27.18,25.69 OLED1.12 OLED1.11 OLED1.10 25.75,24.35 25.53,24.13 24.76,24.13 ; v1(43.56,31.62) 44.7,31.62 44.96,31.37 C22.1 ; USB2.2 2.72,15.36 2.72,24.01 USB2.1 7.44,23.43 USB2.A1B12 8.99,22.89 9.4,22.48 9.4,20.7 9.76,20.34 U8.2 11.49,20.34 v1(12.25,19.57) ; USB2.2 7.49,15.99 7.49,16.43 USB2.B1A12 ; v1(53.97,12.19) 53.97,16.51 v1(53.34,17.15) ; 40.51,30.34 40.88,30.34 v1(41.02,30.48)
  Bottom Layer w0.254: 12.95,18.87 v1(12.25,19.57) ; 12.95,18.87 v1(12.95,15.37) 12.95,4.06 14.86,2.16 17.61,2.16 KEY1.1 KEY1.2 KEY2.1 KEY2.2 ; 12.95,18.87 13.54,18.29 v1(15.62,18.29) ; C25.1 59.47,11.05 v1(58.29,11.05) 55.12,11.05 v1(53.97,12.19) ; 52.19,19.12 R22.1 52.44,17.15 v1(53.34,17.15) ; 52.19,19.12 C23.1 52.13,21.4 53.21,22.48 U9.7 ; 52.19,19.12 62.56,19.12 SIGNAL1.1 63.75,19.56 65.02,20.83 65.02,27.94 64.19,28.78 ADC1.1 ; U1.1 40.43,29.89 v1(41.02,30.48) ; C1.1 v1(43.56,31.62)
  vias: v1(16.89,23.11) v1(17.91,21.21) v2(4.38,36.32) v2(4.38,31.24) v2(4.38,26.16) v2(4.38,21.08) v2(4.38,16) v2(4.38,10.92) v2(9.46,36.32) v2(9.46,26.16) v2(9.46,5.84) v2(9.46,0.76) v2(14.54,36.32) v2(14.54,16) v2(14.54,10.92) v2(14.54,5.84) v2(14.54,0.76) v2(19.62,36.32) v2(19.62,5.84) v2(19.62,0.76) v2(24.7,41.4) v2(24.7,36.32) v2(24.7,31.24) v2(29.78,41.4) v2(29.78,36.32) v2(29.78,31.24) v2(29.78,16) v2(29.78,5.84) v2(29.78,0.76) v2(34.86,41.4) v2(34.86,21.08) v2(34.86,16) v2(39.94,41.4) v2(39.94,31.24) v2(39.94,10.92) v2(39.94,5.84) v2(39.94,0.76) v2(45.02,36.32) v2(45.02,26.16) v2(45.02,16) v2(45.02,5.84) v2(45.02,0.76) v2(50.1,36.32) v2(50.1,31.24) v2(50.1,16) v2(50.1,10.92) v2(50.1,5.84) v2(50.1,0.76) v2(55.18,36.32) v2(55.18,26.16) v2(55.18,16) v2(55.18,10.92) v2(55.18,5.84) v2(55.18,0.76) v2(60.26,36.32) v2(60.26,26.16) v2(60.26,16) v2(60.26,0.76)
DAC1: length 2.7
  Bottom Layer w0.254: R23.1 38.74,18.29 U1.10
DAC2: length 2.7
  Bottom Layer w0.254: R24.1 38.86,16.89 U1.11
DN2: length 7.1
  Top Layer w0.254: U8.4 9.73,19.34 9.63,19.44 5.84,19.44 5.71,19.56 5.71,20.19 5.96,20.43 USB2.B7
DP2: length 6.9
  Top Layer w0.254: v1(8.76,20.57) 8.76,20.07 8.89,19.93 ; v1(8.89,18.8) 8.75,18.94 USB2.B6 ; 8.89,19.93 9.63,19.93 9.73,19.84 U8.3 ; 8.89,19.93 USB2.A6
  Bottom Layer w0.254: v1(8.76,20.57) 8.76,18.92 v1(8.89,18.8)
DTR: length 7.2
  Top Layer w0.254: U8.23 11.5,25.26 R6.1 10.73,27.96 Q2.2
EN: length 32.6
  Top Layer w0.254: Q1.3 v1(13.84,28.21)
  Bottom Layer w0.254: R1.1 41.94,27.35 U1.3 35.14,27.35 30.35,32.13 19.69,32.13 15.77,28.21 v1(13.84,28.21)
GPIO0: length 24.3
  Top Layer w0.254: Q2.3 v1(10.67,30.84)
  Bottom Layer w0.254: U1.25 20.83,13.34 19.3,13.34 18.16,14.48 18.16,17.27 13.33,22.1 12.7,22.1 10.67,24.13 v1(10.67,30.84)
KEY1: length 9.9
  Bottom Layer w0.254: KEY1.3 24.2,7.8 22.61,9.4 22.61,13.72 21.68,14.65 U1.26
KEY2: length 10.9
  Bottom Layer w0.254: KEY2.3 39.16,9.27 35.31,9.27 34.14,10.44 U1.16
LED1: length 14.8
  Top Layer w0.254: LED1.2 23.1,36.44 18.16,31.5 v1(18.16,28.7)
  Bottom Layer w0.254: U1.37 18.25,28.62 v1(18.16,28.7)
LED2: length 16.8
  Top Layer w0.254: LED2.2 28.45,38.74 27.56,37.85 27.56,31.12 v1(26.67,30.23)
  Bottom Layer w0.254: U1.36 23.54,27.35 26.42,30.23 v1(26.67,30.23)
MIC: length 28.7
  Bottom Layer w0.254: ADC1.2 52.27,31.32 41.95,21 U1.8
OLED_CS: length 10.3
  Top Layer w0.254: OLED1.13 27.85,23.4 25.4,20.96 v1(22.99,20.96)
  Bottom Layer w0.254: U1.31 22.95,21 v1(22.99,20.96)
OLED_DC: length 13.4
  Top Layer w0.254: v1(22.99,18.46) 25.44,18.46 29.25,22.26 OLED1.15
  Bottom Layer w0.254: U1.29 v1(22.99,18.46)
OLED_RST: length 11.9
  Top Layer w0.254: OLED1.14 28.55,22.71 25.53,19.69 v1(22.99,19.69)
  Bottom Layer w0.254: U1.30 20.91,19.69 v1(22.99,19.69)
OLED_SCLK: length 15.6
  Top Layer w0.254: OLED1.18 31.35,22.97 25.53,17.15 v1(22.99,17.15)
  Bottom Layer w0.254: v1(22.99,17.15) 20.91,17.15 U1.28
OLED_SDIN: length 17.1
  Top Layer w0.254: OLED1.19 32.05,22.4 25.65,16 v1(22.99,16)
  Bottom Layer w0.254: U1.27 22.9,15.92 v1(22.99,16)
PIN1: length 25
  Bottom Layer w0.254: SIGNAL1.3 44.07,14.48 42.63,15.92 U1.12
PIN2: length 25.5
  Bottom Layer w0.254: U1.13 42.12,14.65 43.31,13.46 59.69,13.46 61.21,11.94 62.99,11.94
RTS: length 15.8
  Top Layer w0.254: Q1.2 12.13,31.7 ; 12.13,31.7 12.18,31.75 14.6,31.75 15.11,31.24 15.11,27.94 13.5,26.33 U8.19 ; 12.13,31.7 12.13,32.77 R7.1
RXD: length 11.3
  Top Layer w0.254: v1(12.19,23.5) 12.5,23.18 U8.21
  Bottom Layer w0.254: v1(12.19,23.5) 13.5,24.81 U1.34
SPEAKER1: length 11.9
  Bottom Layer w0.254: R21.2 54.23,25.77 54.23,25.16 U9.5 62.74,25.02 H1.2
SPEAKER2: length 9.3
  Bottom Layer w0.254: U9.8 58.8,21.21 60.32,22.73 H1.1
TXD: length 12.6
  Top Layer w0.254: v1(12.19,24.51) 13,23.7 U8.20
  Bottom Layer w0.254: U1.35 13.76,26.08 v1(12.19,24.51)
$1N817: length 5
  Top Layer w0.254: C16.2 21.55,29.36 OLED1.4
$1N818: length 3.3
  Top Layer w0.254: OLED1.5 22.25,26.82 22.48,27.05 C16.1
$1N820: length 3.2
  Top Layer w0.254: OLED1.26 36.95,26.81 36.58,27.18 R18.1
$1N821: length 3.2
  Top Layer w0.254: OLED1.27 37.65,27.11 37.97,27.43 C17.2
$1N822: length 3.5
  Top Layer w0.254: OLED1.28 38.34,26.79 39.37,27.81 C18.2
$1N828: length 5
  Top Layer w0.254: C15.1 20.85,29.51 OLED1.3
$1N829: length 3.3
  Top Layer w0.254: OLED1.2 20.15,26.97 20.07,27.05 C15.2
$1N1195: length 4.9
  Top Layer w0.254: C2.1 9.65,16.45 9.65,18.16 9.83,18.34 ; 9.83,18.34 9.78,18.38 9.78,18.8 9.82,18.84 U8.5 ; 9.83,18.34 U8.6
$1N1621: length 5.8
  Top Layer w0.254: Q1.1 14.03,30.29 13.33,29.59 12.83,29.59 12.13,28.89 R6.2
$1N1627: length 6.5
  Top Layer w0.254: Q2.1 8.45,32.58 8.76,32.89 R7.2
$2N655: length 5.7
  Top Layer w0.254: R19.2 40.51,38.23 40,38.75 LED3.1
$2N970: length 5.9
  Bottom Layer w0.254: U9.3 U9.2 49.78,22.48 50.93,21.34 50.93,19.37 C23.2
$2N1135: length 11.4
  Bottom Layer w0.254: R20.2 44.33,22.11 47.24,25.02 U9.4 49.01,25.38 R21.1
$2N1191: length 1.5
  Bottom Layer w0.254: C24.2 45.84,18.34 R20.1
$2N1359: length 4.5
  Bottom Layer w0.254: R22.2 49.02,19.06 49.02,21.19 U9.1
$2N1492: length 3.1
  Bottom Layer w0.254: R24.2 R23.2 C24.1

## Copper pours and planes (outline as drawn; the poured copper is in the pictures)
GND on Top Layer: -4.83,50.8 65.91,50.8 65.91,-0.25 -4.83,-0.25
GND on Bottom Layer: -0.7,46.74 70.04,46.74 70.04,-4.32 -0.7,-4.32

Small or netless copper shapes (teardrops, artwork), in the pictures only: 262 on Top Layer, 112 on Bottom Layer

## Text on the board
Bottom Silkscreen Layer: + | 1 | 2 | 5 | I | G | 33
Top Layer: XS019 | 电路一次就接队
Top Silkscreen Layer: 红色 / 指示灯 | 绿色 / 指示灯 | 电源 / 指示灯 | 麦克风 | 喇叭 | 模拟部分输入/输出 | 模式按键 | 发报按键
